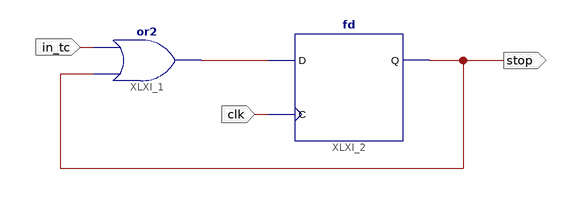
[diagram p0: schematic sheet 1]
// Xilinx ISE schematic ClockStopper.sch (virtex6) as structural Verilog: 2 symbols, 3 ports
module ClockStopper (
  input  in_tc,
  input  clk,
  output stop
);

  wire XLXN_6;

  or XLXI_1 (XLXN_6, stop, in_tc);
  fd XLXI_2 (.C(clk), .D(XLXN_6), .Q(stop));
endmodule
